# EAGLE design MotorCC (EAGLE 6.4)
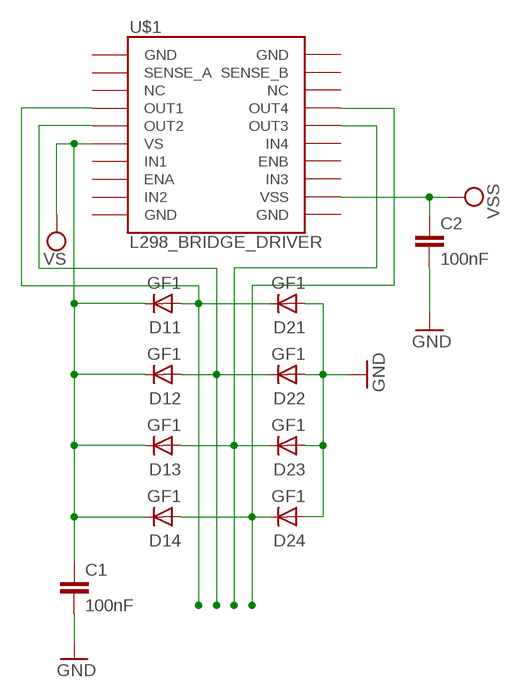
[diagram p0: schematic, sheet 1]

## Parts
C1  100nF  C-EUC0805  [C0805]
C2  100nF  C-EUC0805  [C0805]
D11  GF1  [SMA-DO214AC]
D12  GF1  [SMA-DO214AC]
D13  GF1  [SMA-DO214AC]
D14  GF1  [SMA-DO214AC]
D21  GF1  [SMA-DO214AC]
D22  GF1  [SMA-DO214AC]
D23  GF1  [SMA-DO214AC]
D24  GF1  [SMA-DO214AC]
U$1  L298_BRIDGE_DRIVER  [POWERSO20]

## Nets
GND: C1.2 C2.2 D21.A D22.A D23.A D24.A
N$1: D11.A D21.K(C) U$1.4(OUT1)
N$2: D12.A D22.K(C) U$1.5(OUT2)
N$3: D13.A D23.K(C) U$1.16(OUT3)
N$4: D14.A D24.K(C) U$1.17(OUT4)
VCC: C2.1 U$1.12(VSS) ; supply symbol labelled VSS
VSS: C1.1 D11.K(C) D12.K(C) D13.K(C) D14.K(C) U$1.6(VS) ; supply symbol labelled VS
Unconnected: U$1.1(GND) U$1.2(SENSE_A) U$1.3(NC) U$1.7(IN1) U$1.8(ENA) U$1.9(IN2) U$1.10(GND) U$1.11(GND) U$1.13(IN3) U$1.14(ENB) U$1.15(IN4) U$1.18(NC) U$1.19(SENSE_B) U$1.20(GND)

## Library data of the parts
C1 C2 = resistor:C-EU: CAPACITOR, European symbol
D11-D14 D21-D24 = diode:GF1: DIODE
U$1 = SparkFun-PowerIC:L298_BRIDGE_DRIVER: Full-bridge power driver IC

## Net classes
0 default: width 0.381 mm, drill 0.508 mm, clearance 0.508 mm

## Board
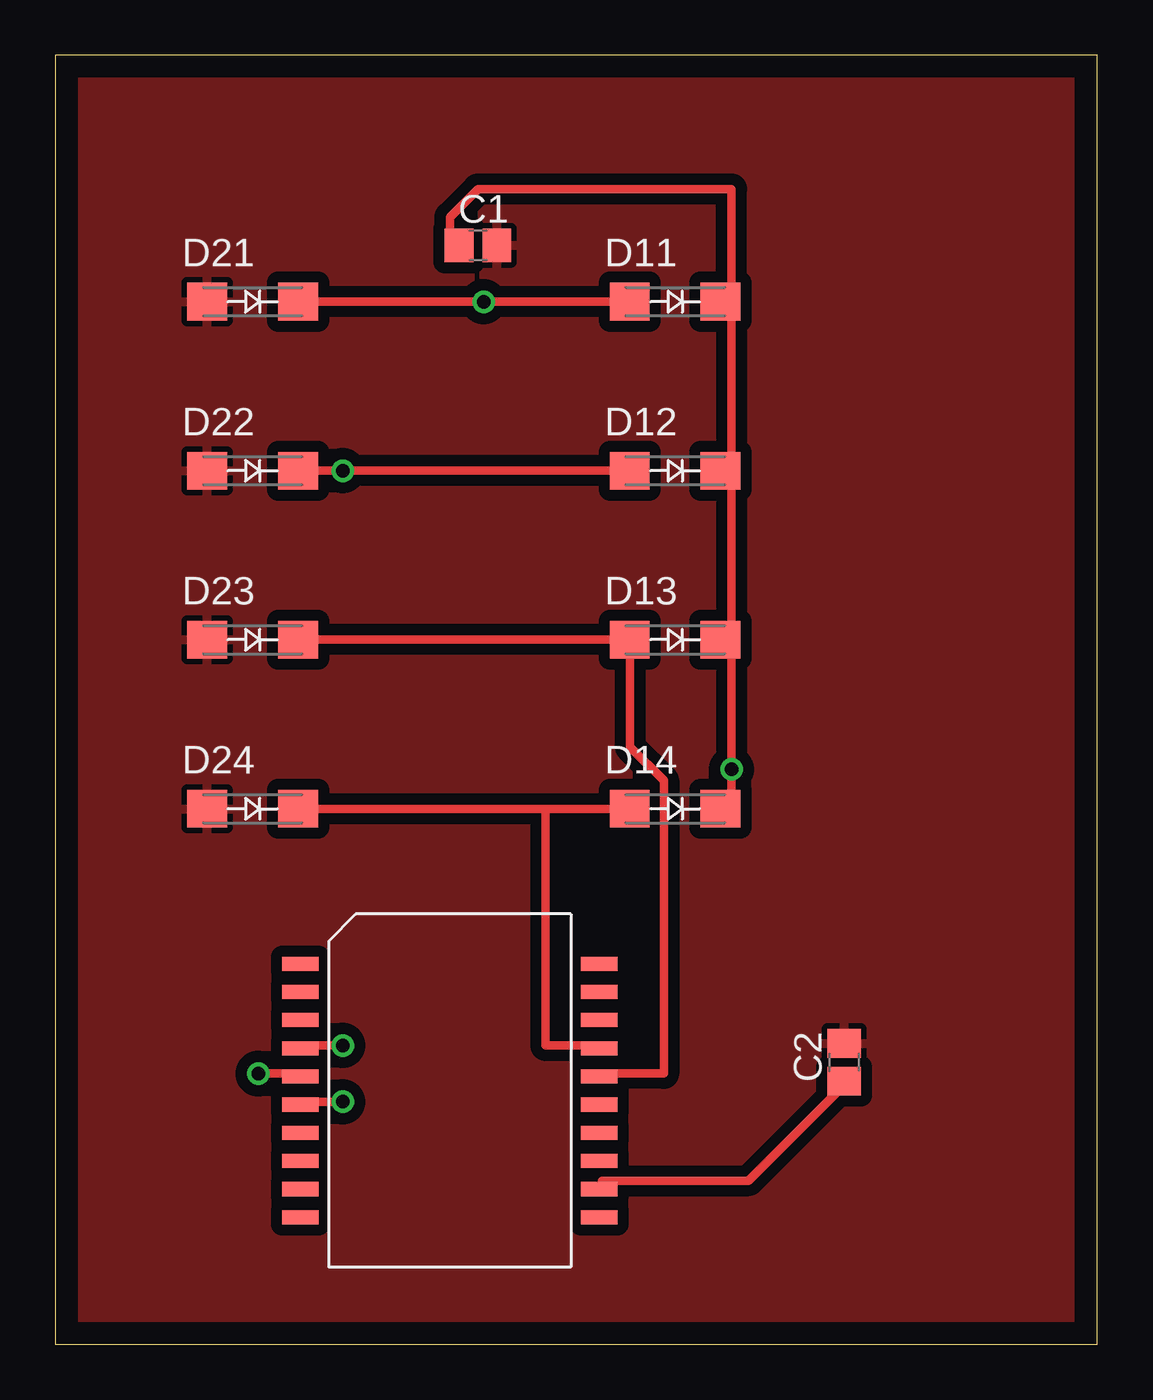
[diagram p1: board, top side]
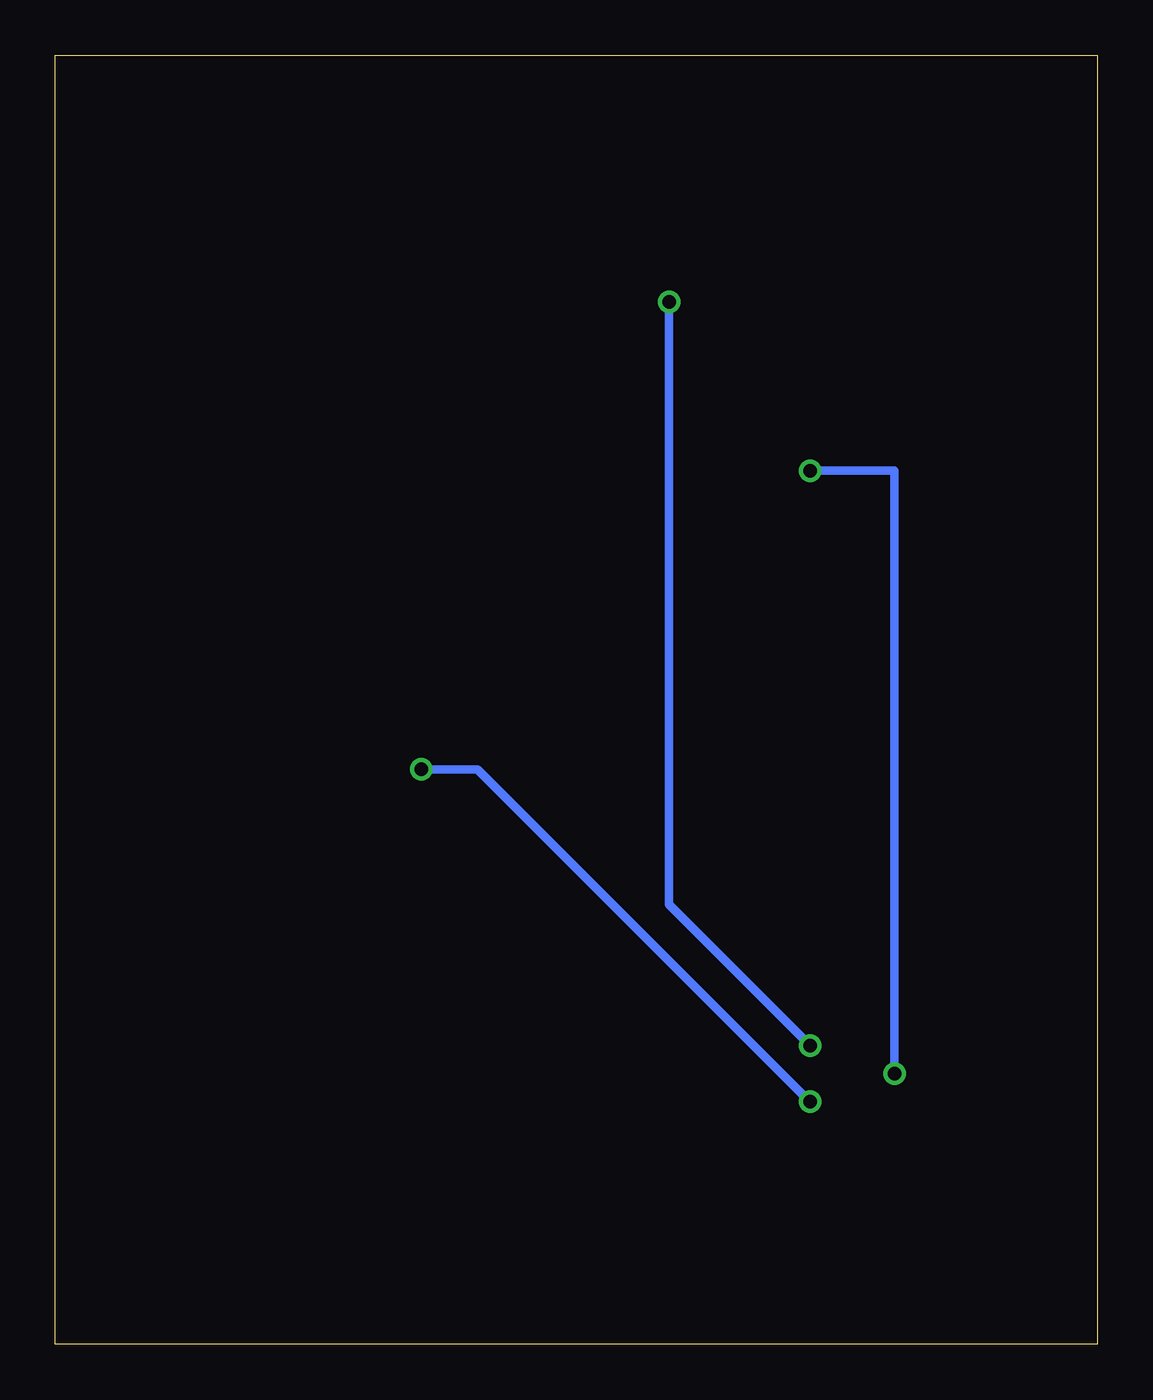
[diagram p2: board, bottom side, seen from below]

Size 46.97 x 58.09 mm. Coordinates in mm from the lower left corner, seen from the top.
Outline: 0,0 46.97,0 46.97,58.09 0,58.09 0,0
Copper layers (1*16): Top 0.035mm / dielectric 1.5mm / Bottom 0.035mm
Design rules "default": minimum track width 10mil, minimum drill 24mil, track to track 8mil, track to pad 8mil, pad to pad 8mil, via to via 8mil, smd to smd 8mil, copper to edge 40mil, drill to drill 8mil, minimum pad ring 10mil, minimum via ring 8mil, stop-mask expansion 4mil, vias tented up to drill 0mil, thermal gap 10mil

### Footprints (pad centres in the part's own frame; a part is rotated, then mirrored left to right if it is on the bottom)
C0805 = smd 1.3 x 1.5: 1 -0.85,0; 2 0.85,0
SMA-DO214AC = smd 1.8 x 1.7: A -2.05,0; K 2.05,0
POWERSO20 = smd 1.651 x 0.635: 1 -6.731,5.715; 2 -6.731,4.445; 3 -6.731,3.175; 4 -6.731,1.905; 5 -6.731,0.635; 6 -6.731,-0.635; 7 -6.731,-1.905; 8 -6.731,-3.175; 9 -6.731,-4.445; 10 -6.731,-5.715; 11 6.731,-5.715; 12 6.731,-4.445; 13 6.731,-3.175; 14 6.731,-1.905; 15 6.731,-0.635; 16 6.731,0.635; 17 6.731,1.905; 18 6.731,3.175; 19 6.731,4.445; 20 6.731,5.715

### Placement (x,y rotation side)
C1  19.05,49.53 0 top
C2  35.56,12.7 90 top
D11  27.94,46.99 0 top
D12  27.94,39.37 0 top
D13  27.94,31.75 0 top
D14  27.94,24.13 0 top
D21  8.89,46.99 0 top
D22  8.89,39.37 0 top
D23  8.89,31.75 0 top
D24  8.89,24.13 0 top
U$1  17.78,11.43 0 top

### Tracks (layer width: path | path; a pad name or v marks a point on that pad's centre or on a via)
GND
  pour Top: -1.27,59.69 48.26,59.69 48.26,58.42 48.26,-1.27 -1.27,-1.27
N$1  (via drill 0.61)
  Top 0.381: D11.A v19.3,46.99 D21.K | v12.95,13.46 11.18,13.46 U$1.4
  Bottom 0.381: v12.95,13.46 19.3,19.81 v19.3,46.99
N$2  (via drill 0.61)
  Top 0.381: D12.A v12.95,39.37 D22.K | v9.14,12.19 10.92,12.19 U$1.5
  Bottom 0.381: v9.14,12.19 9.14,39.37 v12.95,39.37
N$3
  Top 0.381: D23.K D13.A 25.91,31.75 25.91,26.92 27.43,25.4 27.43,12.19 24.64,12.19 U$1.16
N$4
  Top 0.381: D14.A 22.1,24.13 | 22.1,24.13 D24.K | 22.1,24.13 22.1,13.46 24.38,13.46 U$1.17
VCC
  Top 0.381: C2.1 35.56,11.68 31.24,7.37 24.64,7.37 24.64,7.11 U$1.12
VSS  (via drill 0.61)
  Top 0.381: 30.48,31.75 v30.48,25.91 30.48,24.13 D14.K | 30.48,46.99 30.48,52.07 19.05,52.07 17.78,50.8 17.78,49.53 C1.1 | 30.48,46.99 30.48,39.37 | 30.48,46.99 D11.K | 30.48,39.37 30.48,31.75 | 30.48,31.75 D13.K | 30.48,39.37 D12.K | v12.95,10.92 11.18,10.92 U$1.6
  Bottom 0.381: v12.95,10.92 27.94,25.91 v30.48,25.91